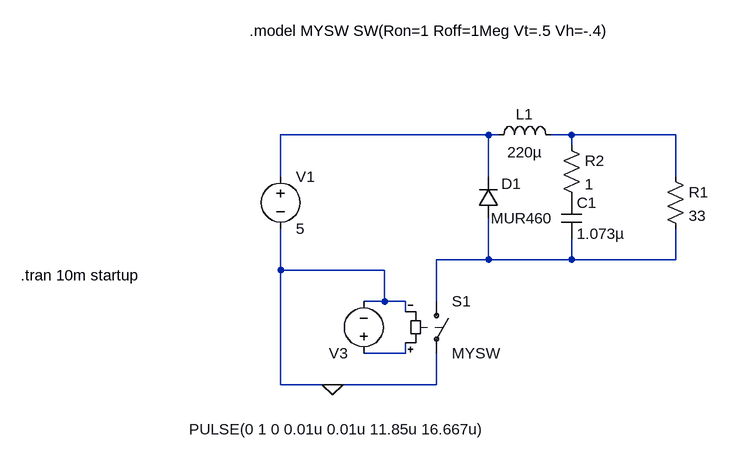
[diagram p0: schematic tp1-pto2.asc]
tp1-pto2.asc, the LTspice schematic file:
Version 4
SHEET 1 880 680
WIRE 432 160 112 160
WIRE 448 160 432 160
WIRE 560 160 528 160
WIRE 720 160 560 160
WIRE 560 176 560 160
WIRE 112 224 112 160
WIRE 432 224 432 160
WIRE 720 224 720 160
WIRE 432 352 432 288
WIRE 432 352 352 352
WIRE 560 352 560 320
WIRE 560 352 432 352
WIRE 720 352 720 304
WIRE 720 352 560 352
WIRE 112 368 112 304
WIRE 272 368 112 368
WIRE 272 416 272 368
WIRE 272 416 240 416
WIRE 304 416 272 416
WIRE 352 416 352 352
WIRE 304 432 304 416
WIRE 304 496 304 480
WIRE 304 496 240 496
WIRE 112 544 112 368
WIRE 192 544 112 544
WIRE 352 544 352 496
WIRE 352 544 192 544
FLAG 192 544 0
SYMBOL diode 448 288 R180
WINDOW 0 -35 53 Left 2
WINDOW 3 -83 0 Left 2
SYMATTR InstName D1
SYMATTR Value MUR460
SYMBOL cap 544 256 R0
SYMATTR InstName C1
SYMATTR Value 1.073µ
SYMBOL ind 432 176 R270
WINDOW 0 32 56 VTop 2
WINDOW 3 5 56 VBottom 2
SYMATTR InstName L1
SYMATTR Value 220µ
SYMBOL res 704 208 R0
SYMATTR InstName R1
SYMATTR Value 33
SYMBOL voltage 112 208 R0
WINDOW 123 0 0 Left 2
WINDOW 39 0 0 Left 2
SYMATTR InstName V1
SYMATTR Value 5
SYMBOL sw 352 400 R0
SYMATTR InstName S1
SYMATTR Value MYSW
SYMBOL voltage 240 512 R180
WINDOW 3 -190 -101 Left 2
WINDOW 123 0 0 Left 2
WINDOW 39 0 0 Left 2
SYMATTR Value PULSE(0 1 0 0.01u 0.01u 11.85u 16.667u)
SYMATTR InstName V3
SYMBOL res 544 160 R0
SYMATTR InstName R2
SYMATTR Value 1
TEXT -288 376 Left 2 !.tran 10m startup
TEXT 64 0 Left 2 !.model MYSW SW(Ron=1 Roff=1Meg Vt=.5 Vh=-.4)

The netlist it stands for:
* tp1-pto2.asc
D1 N003 N001 MUR460
C1 P001 N003 1.073µ
L1 N001 N002 220µ
R1 N002 N003 33
V1 N001 0 5
S1 N003 0 N004 0 MYSW
V3 N004 0 PULSE(0 1 0 0.01u 0.01u 11.85u 16.667u)
R2 N002 P001 1
.model D D
.lib standard.dio
.tran 10m startup
.model MYSW SW(Ron=1 Roff=1Meg Vt=.5 Vh=-.4)
.backanno
.end